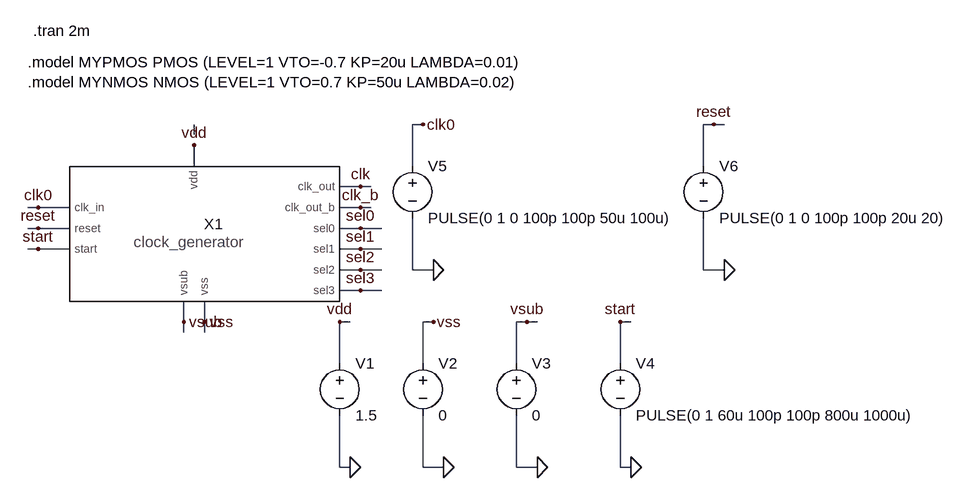
[diagram p0: schematic dsproj_clkgenerator_tb.asc]
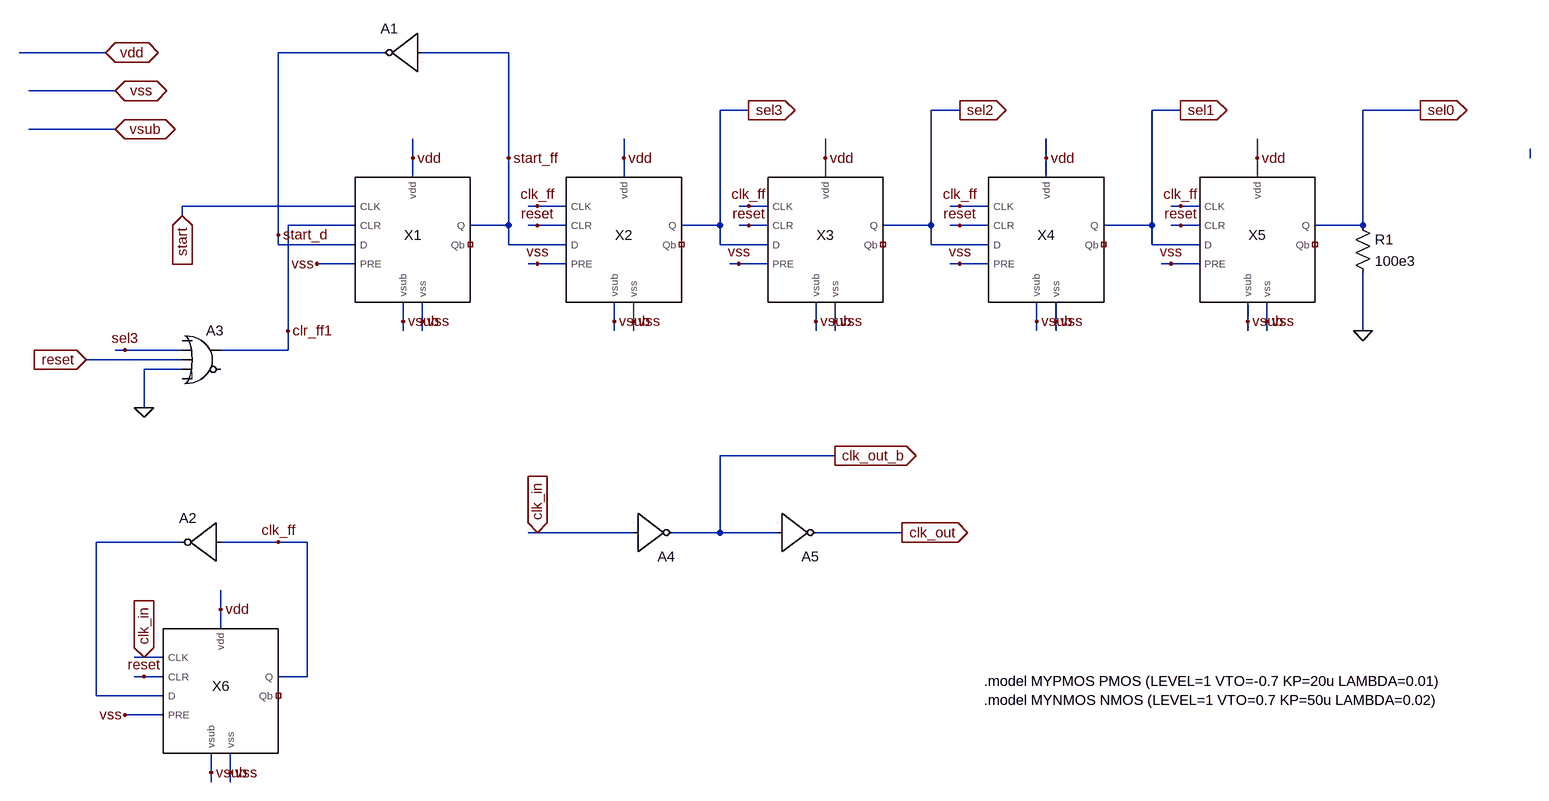
[diagram p1: sub-circuit dsproj_clkgenerator.asc]
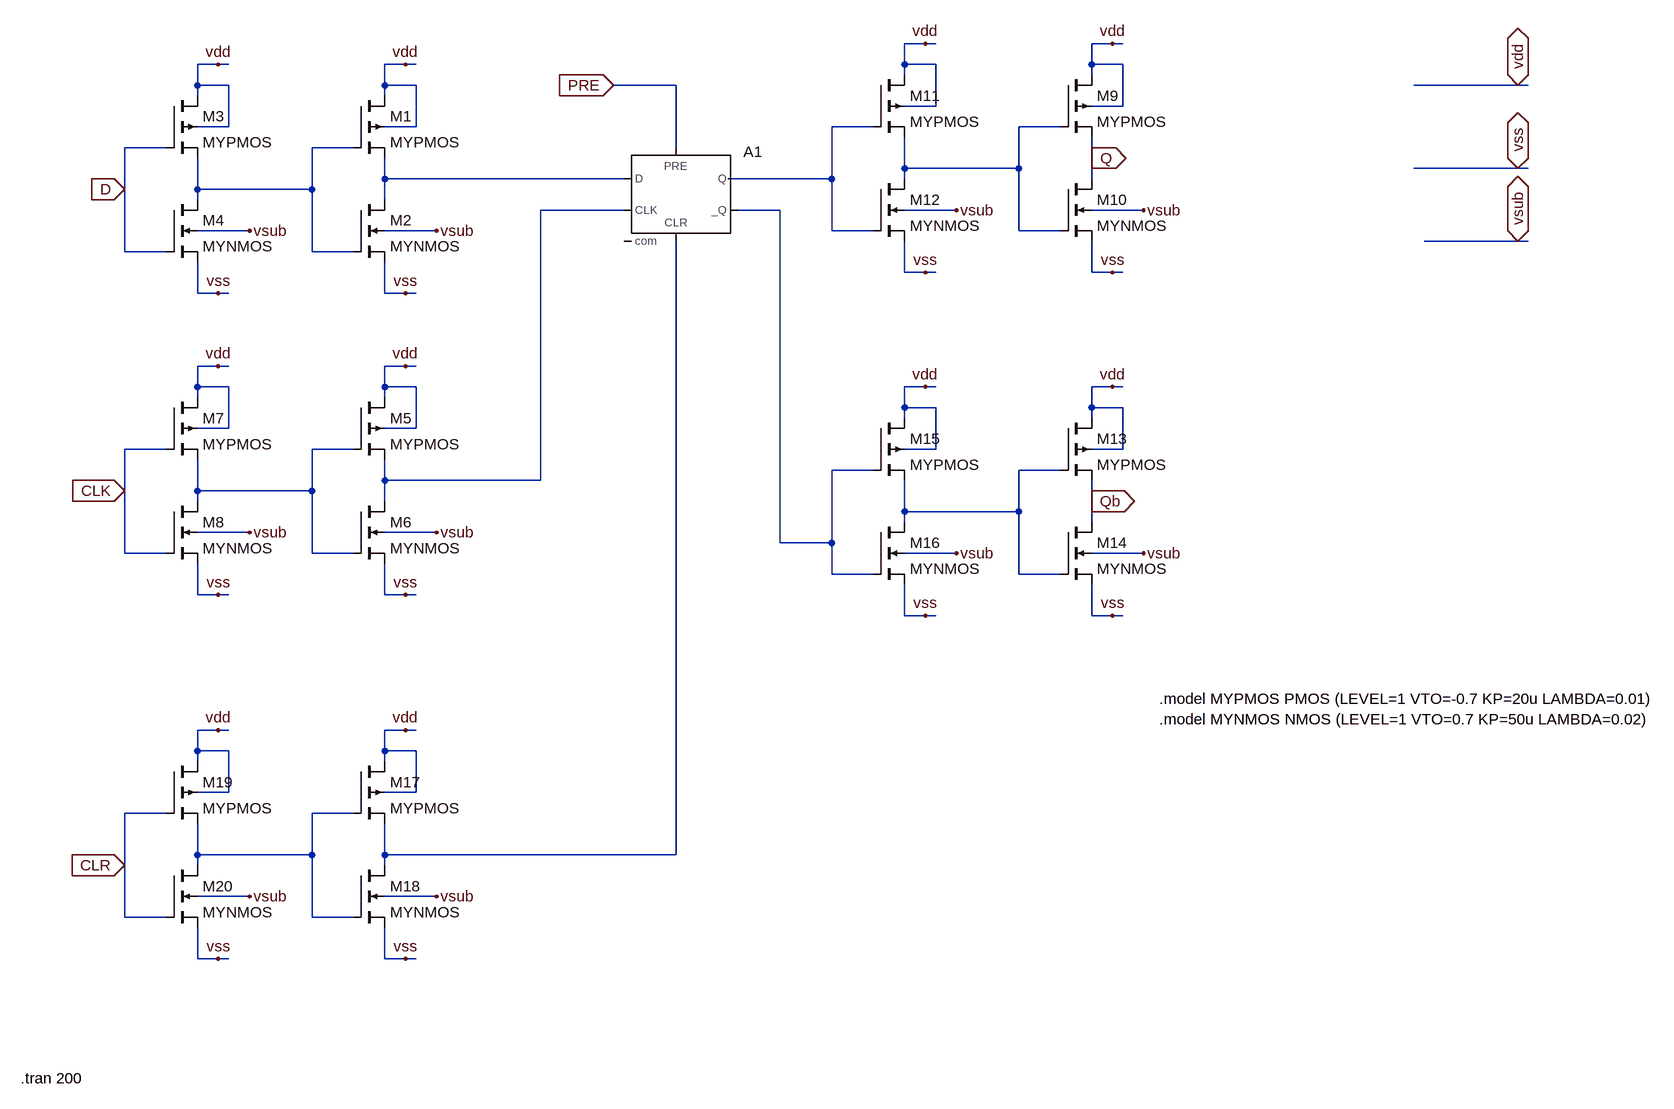
[diagram p2: sub-circuit dsproj_dff.asc]
dsproj_clkgenerator_tb.asc, the LTspice schematic file:
Version 4.1
SHEET 1 1268 680
WIRE 416 -176 400 -176
WIRE 864 -176 848 -176
WIRE 880 -176 864 -176
WIRE 64 -160 64 -176
WIRE 64 -112 64 -144
WIRE 400 -112 400 -176
WIRE 848 -112 848 -176
WIRE 320 -80 288 -80
WIRE 336 -80 320 -80
WIRE -176 -48 -192 -48
WIRE -128 -48 -176 -48
WIRE 320 -48 288 -48
WIRE 336 -48 320 -48
WIRE -176 -16 -192 -16
WIRE -128 -16 -176 -16
WIRE 320 -16 288 -16
WIRE 352 -16 320 -16
WIRE -176 16 -192 16
WIRE -128 16 -176 16
WIRE 320 16 288 16
WIRE 352 16 320 16
WIRE 320 48 288 48
WIRE 352 48 320 48
WIRE 400 48 400 -32
WIRE 432 48 400 48
WIRE 848 48 848 -32
WIRE 880 48 848 48
WIRE 320 80 288 80
WIRE 352 80 320 80
WIRE 48 128 48 96
WIRE 80 128 80 96
WIRE 304 128 288 128
WIRE 432 128 416 128
WIRE 576 128 560 128
WIRE 592 128 576 128
WIRE 736 128 720 128
WIRE 48 144 48 128
WIRE 80 144 80 128
WIRE 288 192 288 128
WIRE 416 192 416 128
WIRE 560 192 560 128
WIRE 720 192 720 128
WIRE 288 352 288 272
WIRE 304 352 288 352
WIRE 416 352 416 272
WIRE 448 352 416 352
WIRE 560 352 560 272
WIRE 592 352 560 352
WIRE 720 352 720 272
WIRE 736 352 720 352
FLAG 64 -144 vdd
FLAG 48 128 vsub
FLAG 80 128 vss
FLAG -176 -48 clk0
FLAG -176 -16 reset
FLAG -176 16 start
FLAG 320 -80 clk
FLAG 320 -48 clk_b
FLAG 320 -16 sel0
FLAG 320 16 sel1
FLAG 320 48 sel2
FLAG 320 80 sel3
FLAG 304 352 0
FLAG 448 352 0
FLAG 592 352 0
FLAG 288 128 vdd
FLAG 432 128 vss
FLAG 576 128 vsub
FLAG 736 352 0
FLAG 432 48 0
FLAG 880 48 0
FLAG 720 128 start
FLAG 416 -176 clk0
FLAG 864 -176 reset
SYMBOL dsproj_clkgenerator 0 32 R0
SYMATTR InstName X1
SYMBOL voltage 288 176 R0
WINDOW 123 0 0 Left 0
WINDOW 39 0 0 Left 0
SYMATTR InstName V1
SYMATTR Value 1.5
SYMBOL voltage 416 176 R0
WINDOW 123 0 0 Left 0
WINDOW 39 0 0 Left 0
SYMATTR InstName V2
SYMATTR Value 0
SYMBOL voltage 560 176 R0
WINDOW 123 0 0 Left 0
WINDOW 39 0 0 Left 0
SYMATTR InstName V3
SYMATTR Value 0
SYMBOL voltage 720 176 R0
WINDOW 123 0 0 Left 0
WINDOW 39 0 0 Left 0
SYMATTR InstName V4
SYMATTR Value PULSE(0 1 60u 100p 100p 800u 1000u)
SYMBOL voltage 400 -128 R0
WINDOW 123 0 0 Left 0
WINDOW 39 0 0 Left 0
SYMATTR InstName V5
SYMATTR Value PULSE(0 1 0 100p 100p 50u 100u)
SYMBOL voltage 848 -128 R0
WINDOW 123 0 0 Left 0
WINDOW 39 0 0 Left 0
SYMATTR InstName V6
SYMATTR Value PULSE(0 1 0 100p 100p 20u 20)
TEXT -184 -320 Left 2 !.tran 2m
TEXT -192 -272 Left 2 !.model MYPMOS PMOS (LEVEL=1 VTO=-0.7 KP=20u LAMBDA=0.01)\n.model MYNMOS NMOS (LEVEL=1 VTO=0.7 KP=50u LAMBDA=0.02)

dsproj_clkgenerator.asc, the sub-circuit schematic file:
Version 4.1
SHEET 1 27204 11108
WIRE -1616 -1728 -1760 -1728
WIRE -1152 -1728 -1328 -1728
WIRE -944 -1728 -1088 -1728
WIRE -1600 -1664 -1744 -1664
WIRE -544 -1632 -592 -1632
WIRE -192 -1632 -240 -1632
WIRE 176 -1632 128 -1632
WIRE 576 -1632 480 -1632
WIRE -1600 -1600 -1744 -1600
WIRE -1104 -1552 -1104 -1584
WIRE -944 -1552 -944 -1728
WIRE -752 -1552 -752 -1584
WIRE -416 -1552 -416 -1584
WIRE -48 -1552 -48 -1584
WIRE 304 -1552 304 -1584
WIRE 1904 -1552 1904 -1568
WIRE -1104 -1520 -1104 -1552
WIRE -752 -1520 -752 -1552
WIRE -416 -1520 -416 -1552
WIRE -48 -1520 -48 -1552
WIRE 304 -1520 304 -1552
WIRE -1200 -1472 -1488 -1472
WIRE -896 -1472 -912 -1472
WIRE -848 -1472 -896 -1472
WIRE -544 -1472 -560 -1472
WIRE -512 -1472 -544 -1472
WIRE -192 -1472 -208 -1472
WIRE -144 -1472 -192 -1472
WIRE 176 -1472 160 -1472
WIRE 208 -1472 176 -1472
WIRE -1488 -1456 -1488 -1472
WIRE -1200 -1440 -1312 -1440
WIRE -944 -1440 -944 -1552
WIRE -944 -1440 -1008 -1440
WIRE -896 -1440 -912 -1440
WIRE -848 -1440 -896 -1440
WIRE -592 -1440 -592 -1632
WIRE -592 -1440 -656 -1440
WIRE -544 -1440 -560 -1440
WIRE -512 -1440 -544 -1440
WIRE -240 -1440 -240 -1632
WIRE -240 -1440 -320 -1440
WIRE -192 -1440 -208 -1440
WIRE -144 -1440 -192 -1440
WIRE 128 -1440 128 -1632
WIRE 128 -1440 48 -1440
WIRE 176 -1440 160 -1440
WIRE 208 -1440 176 -1440
WIRE 480 -1440 480 -1632
WIRE 480 -1440 400 -1440
WIRE -1328 -1424 -1328 -1728
WIRE -1328 -1408 -1328 -1424
WIRE -1200 -1408 -1328 -1408
WIRE -944 -1408 -944 -1440
WIRE -848 -1408 -944 -1408
WIRE -592 -1408 -592 -1440
WIRE -512 -1408 -592 -1408
WIRE -240 -1408 -240 -1440
WIRE -144 -1408 -240 -1408
WIRE 128 -1408 128 -1440
WIRE 208 -1408 128 -1408
WIRE -1200 -1376 -1264 -1376
WIRE -896 -1376 -912 -1376
WIRE -848 -1376 -896 -1376
WIRE -560 -1376 -576 -1376
WIRE -512 -1376 -560 -1376
WIRE -192 -1376 -208 -1376
WIRE -144 -1376 -192 -1376
WIRE 160 -1376 144 -1376
WIRE 208 -1376 160 -1376
WIRE -1120 -1280 -1120 -1312
WIRE -1088 -1280 -1088 -1312
WIRE -768 -1280 -768 -1312
WIRE -736 -1280 -736 -1312
WIRE -432 -1280 -432 -1312
WIRE -400 -1280 -400 -1312
WIRE -64 -1280 -64 -1312
WIRE -32 -1280 -32 -1312
WIRE 288 -1280 288 -1312
WIRE 320 -1280 320 -1312
WIRE -1312 -1264 -1312 -1440
WIRE -1120 -1264 -1120 -1280
WIRE -1088 -1264 -1088 -1280
WIRE -768 -1264 -768 -1280
WIRE -736 -1264 -736 -1280
WIRE -432 -1264 -432 -1280
WIRE -400 -1264 -400 -1280
WIRE -64 -1264 -64 -1280
WIRE -32 -1264 -32 -1280
WIRE 288 -1264 288 -1280
WIRE 320 -1264 320 -1280
WIRE 480 -1264 480 -1360
WIRE -1584 -1232 -1600 -1232
WIRE -1488 -1232 -1584 -1232
WIRE -1312 -1232 -1312 -1264
WIRE -1312 -1232 -1424 -1232
WIRE -1488 -1216 -1648 -1216
WIRE -1488 -1200 -1552 -1200
WIRE -1552 -1136 -1552 -1200
WIRE -400 -1056 -592 -1056
WIRE -896 -928 -912 -928
WIRE -736 -928 -896 -928
WIRE -592 -928 -592 -1056
WIRE -592 -928 -672 -928
WIRE -496 -928 -592 -928
WIRE -288 -928 -432 -928
WIRE -1488 -912 -1632 -912
WIRE -1328 -912 -1424 -912
WIRE -1280 -912 -1328 -912
WIRE -1424 -800 -1424 -832
WIRE -1424 -768 -1424 -800
WIRE -1552 -720 -1568 -720
WIRE -1520 -720 -1552 -720
WIRE -1552 -688 -1568 -688
WIRE -1520 -688 -1552 -688
WIRE -1280 -688 -1280 -912
WIRE -1280 -688 -1328 -688
WIRE -1632 -656 -1632 -912
WIRE -1520 -656 -1632 -656
WIRE -1520 -624 -1584 -624
WIRE -1440 -528 -1440 -560
WIRE -1408 -528 -1408 -560
WIRE -1440 -512 -1440 -528
WIRE -1408 -512 -1408 -528
FLAG -1104 -1552 vdd
FLAG -1120 -1280 vsub
FLAG -1088 -1280 vss
FLAG -752 -1552 vdd
FLAG -768 -1280 vsub
FLAG -736 -1280 vss
FLAG -416 -1552 vdd
FLAG -432 -1280 vsub
FLAG -400 -1280 vss
FLAG -48 -1552 vdd
FLAG -64 -1280 vsub
FLAG -32 -1280 vss
FLAG 304 -1552 vdd
FLAG 288 -1280 vsub
FLAG 320 -1280 vss
FLAG -1424 -800 vdd
FLAG -1440 -528 vsub
FLAG -1408 -528 vss
FLAG -1264 -1376 vss
FLAG -896 -1376 vss
FLAG -560 -1376 vss
FLAG -192 -1376 vss
FLAG 160 -1376 vss
FLAG -1584 -624 vss
FLAG 480 -1264 0
FLAG -896 -1472 clk_ff
FLAG -544 -1472 clk_ff
FLAG -192 -1472 clk_ff
FLAG 176 -1472 clk_ff
FLAG -896 -1440 reset
FLAG -544 -1440 reset
FLAG -192 -1440 reset
FLAG 176 -1440 reset
FLAG -1552 -688 reset
FLAG -1552 -720 clk_in
IOPIN -1552 -720 In
FLAG -944 -1552 start_ff
FLAG -1328 -1424 start_d
FLAG -1488 -1456 start
IOPIN -1488 -1456 In
FLAG -1328 -912 clk_ff
FLAG -544 -1632 sel3
IOPIN -544 -1632 Out
FLAG -192 -1632 sel2
IOPIN -192 -1632 Out
FLAG 176 -1632 sel1
IOPIN 176 -1632 Out
FLAG 576 -1632 sel0
IOPIN 576 -1632 Out
FLAG -1616 -1728 vdd
IOPIN -1616 -1728 BiDir
FLAG -1600 -1664 vss
IOPIN -1600 -1664 BiDir
FLAG -1600 -1600 vsub
IOPIN -1600 -1600 BiDir
FLAG -1584 -1232 sel3
FLAG -1648 -1216 reset
IOPIN -1648 -1216 In
FLAG -1552 -1136 0
FLAG -896 -928 clk_in
IOPIN -896 -928 In
FLAG -288 -928 clk_out
IOPIN -288 -928 Out
FLAG -400 -1056 clk_out_b
IOPIN -400 -1056 Out
FLAG -1312 -1264 clr_ff1
SYMBOL dsproj_dff -1136 -1408 R0
SYMATTR InstName X1
SYMBOL dsproj_dff -784 -1408 R0
SYMATTR InstName X2
SYMBOL dsproj_dff -448 -1408 R0
SYMATTR InstName X3
SYMBOL dsproj_dff -80 -1408 R0
SYMATTR InstName X4
SYMBOL dsproj_dff 272 -1408 R0
SYMATTR InstName X5
SYMBOL dsproj_dff -1456 -656 R0
SYMATTR InstName X6
SYMBOL res 464 -1456 R0
SYMATTR InstName R1
SYMATTR Value 100e3
SYMBOL Digital\\inv -1088 -1792 M0
SYMATTR InstName A1
SYMBOL Digital\\inv -1424 -976 M0
SYMATTR InstName A2
SYMBOL Digital\\or -1456 -1280 R0
SYMATTR InstName A3
SYMBOL Digital\\inv -736 -864 M180
SYMATTR InstName A4
SYMBOL Digital\\inv -496 -864 M180
SYMATTR InstName A5
TEXT -152 -680 Left 2 !.model MYPMOS PMOS (LEVEL=1 VTO=-0.7 KP=20u LAMBDA=0.01)\n.model MYNMOS NMOS (LEVEL=1 VTO=0.7 KP=50u LAMBDA=0.02)

dsproj_dff.asc, the sub-circuit schematic file:
Version 4.1
SHEET 1 1348 1480
WIRE 80 -128 48 -128
WIRE 96 -128 80 -128
WIRE 368 -128 336 -128
WIRE 384 -128 368 -128
WIRE -1008 -96 -1040 -96
WIRE -992 -96 -1008 -96
WIRE -720 -96 -752 -96
WIRE -704 -96 -720 -96
WIRE 48 -96 48 -128
WIRE 96 -96 48 -96
WIRE 336 -96 336 -128
WIRE 384 -96 336 -96
WIRE 48 -80 48 -96
WIRE 336 -80 336 -96
WIRE -1040 -64 -1040 -96
WIRE -992 -64 -1040 -64
WIRE -752 -64 -752 -96
WIRE -704 -64 -752 -64
WIRE -304 -64 -400 -64
WIRE 992 -64 832 -64
WIRE 1008 -64 992 -64
WIRE -1040 -48 -1040 -64
WIRE -752 -48 -752 -64
WIRE 96 -32 96 -96
WIRE 96 -32 48 -32
WIRE 384 -32 384 -96
WIRE 384 -32 336 -32
WIRE -992 0 -992 -64
WIRE -992 0 -1040 0
WIRE -704 0 -704 -64
WIRE -704 0 -752 0
WIRE 0 0 -64 0
WIRE 288 0 224 0
WIRE -1088 32 -1152 32
WIRE -800 32 -864 32
WIRE -304 32 -304 -64
WIRE 336 48 336 16
WIRE 48 64 48 16
WIRE 224 64 224 0
WIRE 224 64 48 64
WIRE 992 64 832 64
WIRE 1008 64 992 64
WIRE -752 80 -752 48
WIRE -384 80 -752 80
WIRE -64 80 -64 0
WIRE -64 80 -224 80
WIRE 48 80 48 64
WIRE 336 80 336 48
WIRE -1152 96 -1152 32
WIRE -1040 96 -1040 48
WIRE -864 96 -864 32
WIRE -864 96 -1040 96
WIRE -1040 112 -1040 96
WIRE -752 112 -752 80
WIRE -384 128 -512 128
WIRE -144 128 -208 128
WIRE 128 128 48 128
WIRE 416 128 336 128
WIRE -960 160 -1040 160
WIRE -672 160 -752 160
WIRE -64 160 -64 80
WIRE 0 160 -64 160
WIRE 224 160 224 64
WIRE 288 160 224 160
WIRE 992 176 848 176
WIRE 1008 176 992 176
WIRE -1152 192 -1152 96
WIRE -1088 192 -1152 192
WIRE -864 192 -864 96
WIRE -800 192 -864 192
WIRE 48 224 48 176
WIRE 80 224 48 224
WIRE 96 224 80 224
WIRE 336 224 336 176
WIRE 368 224 336 224
WIRE 384 224 368 224
WIRE -1040 256 -1040 208
WIRE -1008 256 -1040 256
WIRE -992 256 -1008 256
WIRE -752 256 -752 208
WIRE -720 256 -752 256
WIRE -704 256 -720 256
WIRE -1008 368 -1040 368
WIRE -992 368 -1008 368
WIRE -720 368 -752 368
WIRE -704 368 -720 368
WIRE -1040 400 -1040 368
WIRE -992 400 -1040 400
WIRE -752 400 -752 368
WIRE -704 400 -752 400
WIRE 80 400 48 400
WIRE 96 400 80 400
WIRE 368 400 336 400
WIRE 384 400 368 400
WIRE -1040 416 -1040 400
WIRE -752 416 -752 400
WIRE 48 432 48 400
WIRE 96 432 48 432
WIRE 336 432 336 400
WIRE 384 432 336 432
WIRE 48 448 48 432
WIRE 336 448 336 432
WIRE -992 464 -992 400
WIRE -992 464 -1040 464
WIRE -704 464 -704 400
WIRE -704 464 -752 464
WIRE -1088 496 -1152 496
WIRE -800 496 -864 496
WIRE 96 496 96 432
WIRE 96 496 48 496
WIRE 384 496 384 432
WIRE 384 496 336 496
WIRE 0 528 -64 528
WIRE 288 528 224 528
WIRE -752 544 -752 512
WIRE -512 544 -512 128
WIRE -512 544 -752 544
WIRE -1152 560 -1152 496
WIRE -1040 560 -1040 512
WIRE -864 560 -864 496
WIRE -864 560 -1040 560
WIRE -1040 576 -1040 560
WIRE -752 576 -752 544
WIRE 336 576 336 544
WIRE 48 592 48 544
WIRE 224 592 224 528
WIRE 224 592 48 592
WIRE 48 608 48 592
WIRE 336 608 336 576
WIRE -960 624 -1040 624
WIRE -672 624 -752 624
WIRE -144 640 -144 128
WIRE -64 640 -64 528
WIRE -64 640 -144 640
WIRE -1152 656 -1152 560
WIRE -1088 656 -1152 656
WIRE -864 656 -864 560
WIRE -800 656 -864 656
WIRE 128 656 48 656
WIRE 416 656 336 656
WIRE -64 688 -64 640
WIRE 0 688 -64 688
WIRE 224 688 224 592
WIRE 288 688 224 688
WIRE -1040 720 -1040 672
WIRE -1008 720 -1040 720
WIRE -992 720 -1008 720
WIRE -752 720 -752 672
WIRE -720 720 -752 720
WIRE -704 720 -720 720
WIRE 48 752 48 704
WIRE 80 752 48 752
WIRE 96 752 80 752
WIRE 336 752 336 704
WIRE 368 752 336 752
WIRE 384 752 368 752
WIRE -1008 928 -1040 928
WIRE -992 928 -1008 928
WIRE -720 928 -752 928
WIRE -704 928 -720 928
WIRE -1040 960 -1040 928
WIRE -992 960 -1040 960
WIRE -752 960 -752 928
WIRE -704 960 -752 960
WIRE -1040 976 -1040 960
WIRE -752 976 -752 960
WIRE -992 1024 -992 960
WIRE -992 1024 -1040 1024
WIRE -704 1024 -704 960
WIRE -704 1024 -752 1024
WIRE -1088 1056 -1152 1056
WIRE -800 1056 -864 1056
WIRE -1040 1120 -1040 1072
WIRE -864 1120 -864 1056
WIRE -864 1120 -1040 1120
WIRE -752 1120 -752 1072
WIRE -304 1120 -304 176
WIRE -304 1120 -752 1120
WIRE -1152 1136 -1152 1056
WIRE -1040 1136 -1040 1120
WIRE -752 1136 -752 1120
WIRE -960 1184 -1040 1184
WIRE -672 1184 -752 1184
WIRE -1152 1216 -1152 1136
WIRE -1088 1216 -1152 1216
WIRE -864 1216 -864 1120
WIRE -800 1216 -864 1216
WIRE -1040 1280 -1040 1232
WIRE -1008 1280 -1040 1280
WIRE -992 1280 -1008 1280
WIRE -752 1280 -752 1232
WIRE -720 1280 -752 1280
WIRE -704 1280 -720 1280
FLAG -1008 -96 vdd
FLAG -720 -96 vdd
FLAG -1008 256 vss
FLAG -720 256 vss
FLAG -960 160 vsub
FLAG -672 160 vsub
FLAG -1152 96 D
IOPIN -1152 96 In
FLAG -1008 368 vdd
FLAG -720 368 vdd
FLAG -1008 720 vss
FLAG -720 720 vss
FLAG -960 624 vsub
FLAG -672 624 vsub
FLAG -1152 560 CLK
IOPIN -1152 560 In
FLAG -400 -64 PRE
IOPIN -400 -64 In
FLAG 80 -128 vdd
FLAG 368 -128 vdd
FLAG 80 224 vss
FLAG 368 224 vss
FLAG 128 128 vsub
FLAG 416 128 vsub
FLAG 336 48 Q
IOPIN 336 48 Out
FLAG 80 400 vdd
FLAG 368 400 vdd
FLAG 80 752 vss
FLAG 368 752 vss
FLAG 128 656 vsub
FLAG 416 656 vsub
FLAG 336 576 Qb
IOPIN 336 576 Out
FLAG -1008 928 vdd
FLAG -720 928 vdd
FLAG -1008 1280 vss
FLAG -720 1280 vss
FLAG -960 1184 vsub
FLAG -672 1184 vsub
FLAG -1152 1136 CLR
IOPIN -1152 1136 In
FLAG 992 -64 vdd
IOPIN 992 -64 BiDir
FLAG 992 64 vss
IOPIN 992 64 BiDir
FLAG 992 176 vsub
IOPIN 992 176 BiDir
SYMBOL Digital\\dflop -304 32 R0
SYMATTR InstName A1
SYMBOL pmos4 -800 -48 R0
SYMATTR InstName M1
SYMATTR Value MYPMOS
SYMATTR Value2 l=180e-9 w=2400e-9
SYMBOL nmos4 -800 112 R0
SYMATTR InstName M2
SYMATTR Value MYNMOS
SYMATTR Value2 l=180e-9 w=1200e-9
SYMBOL pmos4 -1088 -48 R0
SYMATTR InstName M3
SYMATTR Value MYPMOS
SYMATTR Value2 l=180e-9 w=2400e-9
SYMBOL nmos4 -1088 112 R0
SYMATTR InstName M4
SYMATTR Value MYNMOS
SYMATTR Value2 l=180e-9 w=1200e-9
SYMBOL pmos4 -800 416 R0
SYMATTR InstName M5
SYMATTR Value MYPMOS
SYMATTR Value2 l=180e-9 w=2400e-9
SYMBOL nmos4 -800 576 R0
SYMATTR InstName M6
SYMATTR Value MYNMOS
SYMATTR Value2 l=180e-9 w=1200e-9
SYMBOL pmos4 -1088 416 R0
SYMATTR InstName M7
SYMATTR Value MYPMOS
SYMATTR Value2 l=180e-9 w=2400e-9
SYMBOL nmos4 -1088 576 R0
SYMATTR InstName M8
SYMATTR Value MYNMOS
SYMATTR Value2 l=180e-9 w=1200e-9
SYMBOL pmos4 288 -80 R0
SYMATTR InstName M9
SYMATTR Value MYPMOS
SYMATTR Value2 l=180e-9 w=2400e-9
SYMBOL nmos4 288 80 R0
SYMATTR InstName M10
SYMATTR Value MYNMOS
SYMATTR Value2 l=180e-9 w=1200e-9
SYMBOL pmos4 0 -80 R0
SYMATTR InstName M11
SYMATTR Value MYPMOS
SYMATTR Value2 l=180e-9 w=2400e-9
SYMBOL nmos4 0 80 R0
SYMATTR InstName M12
SYMATTR Value MYNMOS
SYMATTR Value2 l=180e-9 w=1200e-9
SYMBOL pmos4 288 448 R0
SYMATTR InstName M13
SYMATTR Value MYPMOS
SYMATTR Value2 l=180e-9 w=2400e-9
SYMBOL nmos4 288 608 R0
SYMATTR InstName M14
SYMATTR Value MYNMOS
SYMATTR Value2 l=180e-9 w=1200e-9
SYMBOL pmos4 0 448 R0
SYMATTR InstName M15
SYMATTR Value MYPMOS
SYMATTR Value2 l=180e-9 w=2400e-9
SYMBOL nmos4 0 608 R0
SYMATTR InstName M16
SYMATTR Value MYNMOS
SYMATTR Value2 l=180e-9 w=1200e-9
SYMBOL pmos4 -800 976 R0
SYMATTR InstName M17
SYMATTR Value MYPMOS
SYMATTR Value2 l=180e-9 w=2400e-9
SYMBOL nmos4 -800 1136 R0
SYMATTR InstName M18
SYMATTR Value MYNMOS
SYMATTR Value2 l=180e-9 w=1200e-9
SYMBOL pmos4 -1088 976 R0
SYMATTR InstName M19
SYMATTR Value MYPMOS
SYMATTR Value2 l=180e-9 w=2400e-9
SYMBOL nmos4 -1088 1136 R0
SYMATTR InstName M20
SYMATTR Value MYNMOS
SYMATTR Value2 l=180e-9 w=1200e-9
TEXT -1312 1464 Left 2 !.tran 200
TEXT 440 880 Left 2 !.model MYPMOS PMOS (LEVEL=1 VTO=-0.7 KP=20u LAMBDA=0.01)\n.model MYNMOS NMOS (LEVEL=1 VTO=0.7 KP=50u LAMBDA=0.02)

The netlist it stands for:
* dsproj_clkgenerator_tb.asc
X§X1 clk0 reset start clk clk_b sel0 sel1 sel2 sel3 vdd vss vsub dsproj_clkgenerator
V1 vdd 0 1.5
V2 vss 0 0
V3 vsub 0 0
V4 start 0 PULSE(0 1 60u 100p 100p 800u 1000u)
V5 clk0 0 PULSE(0 1 0 100p 100p 50u 100u)
V6 reset 0 PULSE(0 1 0 100p 100p 20u 20)

* block symbol definitions
.subckt dsproj_clkgenerator clk_in reset start clk_out clk_out_b sel0 sel1 sel2 sel3 vdd vss vsub
X§X1 start clr_ff1 start_d vss start_ff NC_01 vdd vss vsub dsproj_dff
X§X2 clk_ff reset start_ff vss sel3 NC_02 vdd vss vsub dsproj_dff
X§X3 clk_ff reset sel3 vss sel2 NC_03 vdd vss vsub dsproj_dff
X§X4 clk_ff reset sel2 vss sel1 NC_04 vdd vss vsub dsproj_dff
X§X5 clk_ff reset sel1 vss sel0 NC_05 vdd vss vsub dsproj_dff
X§X6 clk_in reset N002 vss clk_ff NC_06 vdd vss vsub dsproj_dff
R1 sel0 0 100e3
A1 start_ff 0 0 0 0 start_d 0 0 BUF
A2 clk_ff 0 0 0 0 N002 0 0 BUF
A3 0 sel3 reset 0 0 0 clr_ff1 0 OR
A4 clk_in 0 0 0 0 clk_out_b 0 0 BUF
A5 clk_out_b 0 0 0 0 clk_out 0 0 BUF
.model MYPMOS PMOS (LEVEL=1 VTO=-0.7 KP=20u LAMBDA=0.01)
.model MYNMOS NMOS (LEVEL=1 VTO=0.7 KP=50u LAMBDA=0.02)
.ends dsproj_clkgenerator

.subckt dsproj_dff CLK CLR D PRE Q Qb vdd vss vsub
A1 N004 0 N005 PRE N010 N006 N001 0 DFLOP
M1 vdd N003 N004 vdd MYPMOS l=180e-9 w=2400e-9
M2 N004 N003 vss vsub MYNMOS l=180e-9 w=1200e-9
M3 vdd D N003 vdd MYPMOS l=180e-9 w=2400e-9
M4 N003 D vss vsub MYNMOS l=180e-9 w=1200e-9
M5 vdd N007 N005 vdd MYPMOS l=180e-9 w=2400e-9
M6 N005 N007 vss vsub MYNMOS l=180e-9 w=1200e-9
M7 vdd CLK N007 vdd MYPMOS l=180e-9 w=2400e-9
M8 N007 CLK vss vsub MYNMOS l=180e-9 w=1200e-9
M9 vdd N002 Q vdd MYPMOS l=180e-9 w=2400e-9
M10 Q N002 vss vsub MYNMOS l=180e-9 w=1200e-9
M11 vdd N001 N002 vdd MYPMOS l=180e-9 w=2400e-9
M12 N002 N001 vss vsub MYNMOS l=180e-9 w=1200e-9
M13 vdd N008 Qb vdd MYPMOS l=180e-9 w=2400e-9
M14 Qb N008 vss vsub MYNMOS l=180e-9 w=1200e-9
M15 vdd N006 N008 vdd MYPMOS l=180e-9 w=2400e-9
M16 N008 N006 vss vsub MYNMOS l=180e-9 w=1200e-9
M17 vdd N009 N010 vdd MYPMOS l=180e-9 w=2400e-9
M18 N010 N009 vss vsub MYNMOS l=180e-9 w=1200e-9
M19 vdd CLR N009 vdd MYPMOS l=180e-9 w=2400e-9
M20 N009 CLR vss vsub MYNMOS l=180e-9 w=1200e-9
.tran 200
.model MYPMOS PMOS (LEVEL=1 VTO=-0.7 KP=20u LAMBDA=0.01)
.model MYNMOS NMOS (LEVEL=1 VTO=0.7 KP=50u LAMBDA=0.02)
.ends dsproj_dff

.model NMOS NMOS
.model PMOS PMOS
.lib standard.mos
.tran 2m
.model MYPMOS PMOS (LEVEL=1 VTO=-0.7 KP=20u LAMBDA=0.01)
.model MYNMOS NMOS (LEVEL=1 VTO=0.7 KP=50u LAMBDA=0.02)
.backanno
.end